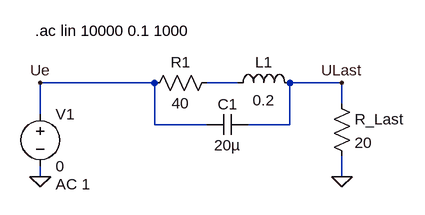
[diagram p0: schematic Draft4.asc]
Draft4.asc, the LTspice schematic file:
Version 4
SHEET 1 880 680
WIRE 256 80 80 80
WIRE 384 80 336 80
WIRE 544 80 464 80
WIRE 544 112 544 80
WIRE 80 128 80 80
WIRE 256 144 256 80
WIRE 336 144 256 144
WIRE 464 144 464 80
WIRE 464 144 400 144
WIRE 80 224 80 208
WIRE 544 224 544 192
FLAG 80 224 0
FLAG 544 224 0
FLAG 80 80 Ue
FLAG 544 80 ULast
SYMBOL voltage 80 112 R0
WINDOW 123 24 124 Left 2
WINDOW 39 0 0 Left 2
SYMATTR Value2 AC 1
SYMATTR InstName V1
SYMATTR Value 0
SYMBOL res 240 96 R270
WINDOW 0 32 56 VTop 2
WINDOW 3 0 56 VBottom 2
SYMATTR InstName R1
SYMATTR Value 40
SYMBOL ind 368 96 R270
WINDOW 0 32 56 VTop 2
WINDOW 3 5 56 VBottom 2
SYMATTR InstName L1
SYMATTR Value 0.2
SYMBOL cap 400 128 R90
WINDOW 0 0 32 VBottom 2
WINDOW 3 32 32 VTop 2
SYMATTR InstName C1
SYMATTR Value 20µ
SYMBOL res 528 96 R0
SYMATTR InstName R_Last
SYMATTR Value 20
TEXT 72 0 Left 2 !.ac lin 10000 0.1 1000

The netlist it stands for:
* Draft4.asc
V1 Ue 0 0 AC 1
R1 Ue N001 40
L1 N001 ULast 0.2
C1 ULast Ue 20µ
R_Last ULast 0 20
.ac lin 10000 0.1 1000
.backanno
.end